# Altium project MiniPC.PrjPcb (part 17 of 17)
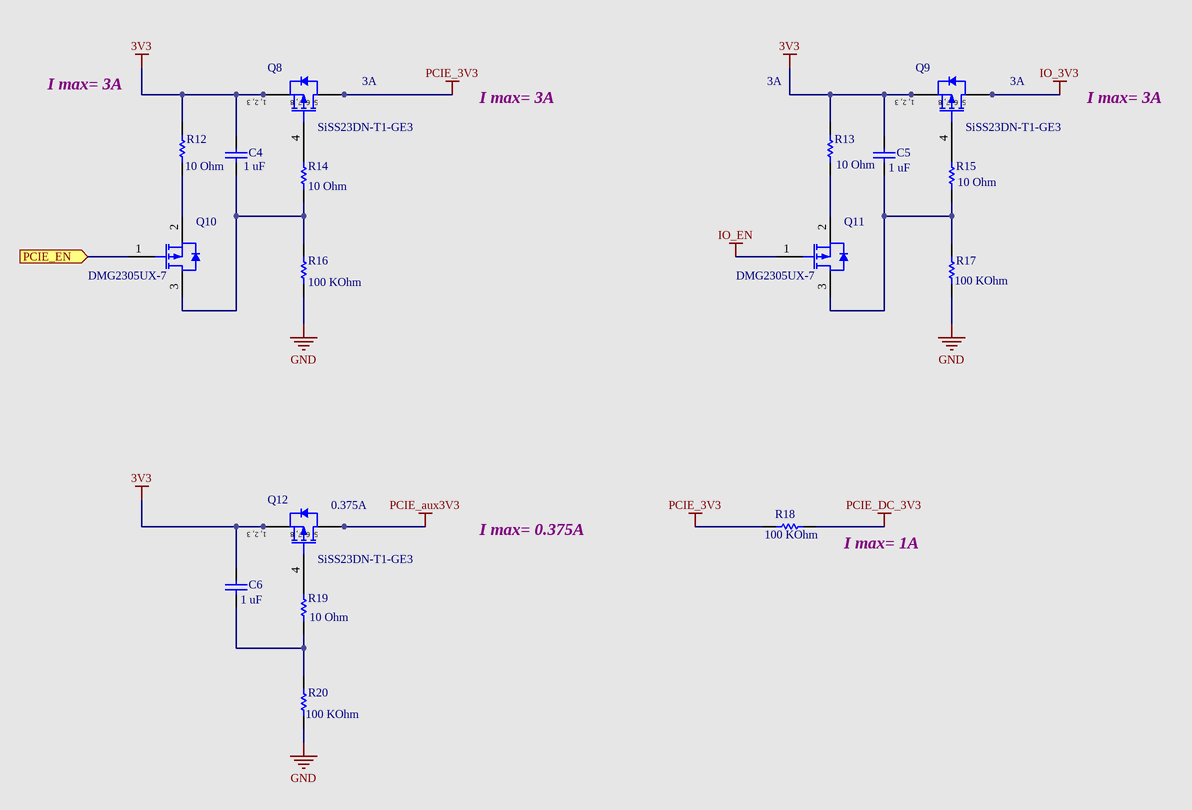
[diagram p51: 3.3V_and_1.8V_Load.SchDoc]

## Nets that join several sheets
0V95: Core_Power_Decoupling (7 pins), Arria10_Power (6 pins), 3V3_to_0V9 (12 pins)
1V8: 12V_3V3_1V8_Swiches (Q17.5 Q17.6 Q17.7 Q17.8), 3V3_to_1V8 (R96.1 R98.2)
2V5: 3V3_to_2V5 (R104.2 R105.2), 2.5V_and_1.8V_Switches (5 pins)
3V3: JTAG_Connector (J12.4 R329.2 R330.1 R331.1), miniPCIE_Connector (C481.2 C482.1 J13.2 J13.52), 12V_3V3_1V8_Swiches (8 pins), 12V_to_3V3 (34 pins), 3V3_to_2V5 (7 pins), 3V3_to_1V8 (19 pins), 3.3V_and_1.8V_Load (14 pins)
A10_0V9: Core_Power_Decoupling (120 pins), Arria10_Power (104 pins), 12V_to_0V9 (36 pins)
A10_0V95_EN: 3.3V_to_0.9V (R31.2), 3V3_to_0V9 (R87.1)
A10_1V0: IO_Power_Decoupling (33 pins), Arria10_Power (32 pins), 3.3V_to_1.0V (R42.1 R44.2)
A10_12V: 12V_3V3_1V8_Swiches (5 pins), 12V_to_0V9 (21 pins)
A10_GNDSENSE: Arria10_Ground (U1.AA18), 12V_to_0V9 (R143.2)
A10_main_1V8: 12V_3V3_1V8_Swiches (5 pins), 2.5V_and_1.8V_Switches (8 pins)
A10_main_3V3: 12V_3V3_1V8_Swiches (Q14.1 Q14.2 Q14.3), 3.3V_to_0.9V (14 pins), 3.3V_to_1.0V (18 pins), 3.3V_to_DDR4_VDD (14 pins), 3.3V_to_VADJ (15 pins), 3V3_to_0V9 (6 pins)
A10_VCCAPLL: IO_Power_Decoupling (C458.2 C459.2 L15.2), Arria10_Power (U1.W18)
A10_VCCLSENSE: Arria10_Power (U1.AA19), 12V_to_0V9 (R142.2)
A10VCCAPLLHPS: IO_Power_Decoupling (C463.2 L16.2), Arria10_Power (U1.N18)
FMCBVADJ: IO_Power_Decoupling (C460.2 C461.2 C462.2), Arria10_Power (16 pins), 3.3V_to_VADJ (R67.2 R69.1)
GND: Core_Power_Decoupling (132 pins), IO_Power_Decoupling (91 pins), DDR4_SODIMM_Arria10 (R237.1), PCIE_Arria10 (8 pins), DP&SDI_Arria10 (12 pins), 2XSFP_Arria10 (U1.AJ28 U1.AJ29), HPS1_Arria10 (7 pins), Arria10_Power (28 pins), Arria10_Ground (401 pins), DDR4 (60 pins), DDR4_SODIMM1 (106 pins), DDR4_SODIMM2 (106 pins), Ethernet-HPS (39 pins), SFP_PortA (31 pins), SFP_PortB (31 pins), JTAG_Connector (J12.10 R328.1), Display_Port (20 pins), Ethernet1 (39 pins), Ethernet2 (39 pins), miniPCIE_Connector (18 pins), USB3.0 (22 pins), PCIE_Connector (50 pins), PLL1 (33 pins), PLL (37 pins), 12V_POWER (13 pins), 12V_3V3_1V8_Swiches (13 pins), 12V_to_0V9 (61 pins), 12V_to_3V3 (59 pins), 12V_to_5V (11 pins), 3.3V_to_0.9V (14 pins), 3.3V_to_1.0V (15 pins), 3.3V_to_DDR4_VDD (14 pins), 3.3V_to_VADJ (14 pins), 3V3_to_0V9 (11 pins), 3V3_to_2V5 (11 pins), 3V3_to_1V8 (15 pins), 2.5V_and_1.8V_Switches (7 pins), 3.3V_and_1.8V_Load (R16.1 R17.1 R20.1)
HPS_0V95: Core_Power_Decoupling (5 pins), Arria10_Power (U1.N17 U1.P16 U1.P18 U1.R18), 3.3V_to_0.9V (R25.2 R27.1)
IO_1V8: IO_Power_Decoupling (14 pins), HPS1_Arria10 (9 pins), Arria10_Power (18 pins), Ethernet-HPS (11 pins), USB3.0 (11 pins), PLL1 (L17.2 L18.2 R333.1 R334.1), PLL (5 pins), 2.5V_and_1.8V_Switches (Q3.1 Q3.2 Q3.3)
IO_2V5: DDR4 (6 pins), DDR4_SODIMM1 (J8.255 J8.257 J8.259 R227.1), DDR4_SODIMM2 (J20.255 J20.257 J20.259 R232.1), Ethernet-HPS (7 pins), Ethernet1 (40 pins), Ethernet2 (40 pins), USB3.0 (X1.4), PLL (9 pins), 2.5V_and_1.8V_Switches (Q1.5 Q1.6 Q1.7 Q1.8)
IO_3V3: Ethernet-HPS (5 pins), SFP_PortA (C551.2 C552.2 L23.1 L24.1), SFP_PortB (C555.2 C557.2 L25.1 L26.1), Display_Port (C297.1 R242.2 U16.5), USB3.0 (6 pins), PLL (C541.2 C542.2 U29.1 U29.10), 3.3V_and_1.8V_Load (Q9.5 Q9.6 Q9.7 Q9.8)
IO_5V: Ethernet-HPS (C384.2 U25.5), Ethernet1 (C327.2 U19.1), Ethernet2 (C353.2 U22.1), 12V_to_5V (11 pins)
IO_EN: 3.3V_to_DDR4_VDD (R59.2), 2.5V_and_1.8V_Switches (Q2.1 R7.2), 3.3V_and_1.8V_Load (Q11.1)
MAIN_12V: 12V_POWER (18 pins), 12V_3V3_1V8_Swiches (8 pins), 12V_to_3V3 (21 pins), 12V_to_5V (F1.2), 2.5V_and_1.8V_Switches (R4.2 R5.2 R8.2 R10.2)
PCIE_12V: PCIE_Connector (11 pins), 12V_POWER (Q21.5 Q21.6 Q21.7 Q21.8)
PCIE_aux3V3: PCIE_Connector (C483.2 J14.B10), 3.3V_and_1.8V_Load (Q12.5 Q12.6 Q12.7 Q12.8)
PCIE_DC_3V3: PCIE_Connector (7 pins), 3.3V_and_1.8V_Load (R18.1)
PCIE_EN: 12V_POWER (R139.1), 3.3V_and_1.8V_Load (Q10.1)
PLL_1V8: IO_Power_Decoupling (25 pins), Arria10_Power (22 pins), 2.5V_and_1.8V_Switches (Q4.1 Q4.2 Q4.3)
PMbus_ALTERTn: 12V_to_0V9 (U10#1.E5), 12V_to_3V3 (R161.1 U23.E5)
PMbus_SCL_3V3: 12V_to_0V9 (U10#1.E6), 12V_to_3V3 (R159.1 U23.E6)
PMbus_SDA_3V3: 12V_to_0V9 (U10#1.D6), 12V_to_3V3 (R160.1 U23.D6)
VCCIO_HPS: IO_Power_Decoupling (C464.2 R326.2), Arria10_Power (U1.M16)
VCCIOREF_HPS: IO_Power_Decoupling (C480.2 R327.2), Arria10_Power (U1.N16)
VDD_DDR: IO_Power_Decoupling (15 pins), Arria10_Power (20 pins), DDR4 (72 pins), DDR4_SODIMM1 (25 pins), DDR4_SODIMM2 (25 pins), 3.3V_to_DDR4_VDD (R53.2 R55.1)
A10_HLVDDI_N: 3.3V_to_1.0V (C23.1 R45.1), 3.3V_to_DDR4_VDD (C26.1 R53.1)
A10_HLVDDI_P: 3.3V_to_1.0V (C23.2 R44.1), 3.3V_to_DDR4_VDD (C26.2 R51.1)
CLK_ENET_FPGA_N: PCIE_Arria10 (U1.AG28), PLL1 (C516.2)
CLK_ENET_FPGA_P: PCIE_Arria10 (U1.AG29), PLL1 (C517.2)
CLOCK_I2C_SCL: PLL1 (U27.12 U28.12), PLL (U30.12)
CLOCK_I2C_SDA: PLL1 (U27.19 U28.19), PLL (U30.19)
DDR4_A0: DDR4_Arria10 (U1.G26), DDR4 (R211.2 U14.P3 U15.P3)
DDR4_A1: DDR4_Arria10 (U1.F23), DDR4 (R212.2 U14.P7 U15.P7)
DDR4_A2: DDR4_Arria10 (U1.D25), DDR4 (R213.2 U14.R3 U15.R3)
DDR4_A3: DDR4_Arria10 (U1.F24), DDR4 (R214.2 U14.N7 U15.N7)
DDR4_A4: DDR4_Arria10 (U1.H24), DDR4 (R215.2 U14.N3 U15.N3)
DDR4_A5: DDR4_Arria10 (U1.B22), DDR4 (R216.2 U14.P8 U15.P8)
DDR4_A6: DDR4_Arria10 (U1.G25), DDR4 (R217.2 U14.P2 U15.P2)
DDR4_A7: DDR4_Arria10 (U1.A20), DDR4 (R218.2 U14.R8 U15.R8)
DDR4_A8: DDR4_Arria10 (U1.E23), DDR4 (R219.2 U14.R2 U15.R2)
DDR4_A9: DDR4_Arria10 (U1.E25), DDR4 (R220.2 U14.R7 U15.R7)
DDR4_A10: DDR4_Arria10 (U1.J24), DDR4 (R222.2 U14.M3 U15.M3)
DDR4_A11: DDR4_Arria10 (U1.C24), DDR4 (R224.2 U14.T2 U15.T2)
DDR4_A12: DDR4_Arria10 (U1.F26), DDR4 (R225.2 U14.M7 U15.M7)
DDR4_A13: DDR4_Arria10 (U1.A19), DDR4 (R226.2 U14.T8 U15.T8)
DDR4_ACT: DDR4_Arria10 (U1.J25), DDR4 (U14.L3 U15.L3)
DDR4_ALERT0: DDR4_Arria10 (U1.L26), DDR4 (U15.P9)
DDR4_ALERT1: DDR4_Arria10 (U1.A22), DDR4 (U14.P9)
DDR4_BA0: DDR4_Arria10 (U1.M24), DDR4 (U14.N2 U15.N2)
DDR4_BA1: DDR4_Arria10 (U1.A23), DDR4 (U14.N8 U15.N8)
DDR4_BG0: DDR4_Arria10 (U1.N24), DDR4 (U15.M2)
DDR4_BG1: DDR4_Arria10 (U1.M25), DDR4 (U14.M2)
DDR4_CAS: DDR4_Arria10 (U1.A24), DDR4 (U14.M8 U15.M8)
DDR4_CKE: DDR4_Arria10 (U1.P25), DDR4 (U14.K2 U15.K2)
DDR4_CLK_N: DDR4_Arria10 (U1.B19), DDR4 (U14.K8 U15.K8)
DDR4_CLK_P: DDR4_Arria10 (U1.B20), DDR4 (U14.K7 U15.K7)
DDR4_CSn: DDR4_Arria10 (U1.A26), DDR4 (U14.L7 U15.L7)
DDR4_DM0: DDR4_Arria10 (U1.AV28), DDR4 (U15.E7)
DDR4_DM1: DDR4_Arria10 (U1.AT23), DDR4 (U15.E2)
DDR4_DM2: DDR4_Arria10 (U1.AK23), DDR4 (U14.E7)
DDR4_DM3: DDR4_Arria10 (U1.AJ26), DDR4 (U14.E2)
DDR4_DQ0: DDR4_Arria10 (U1.AV26), DDR4 (U15.G2)
DDR4_DQ1: DDR4_Arria10 (U1.AW28), DDR4 (U15.F7)
DDR4_DQ2: DDR4_Arria10 (U1.AV24), DDR4 (U15.H3)
DDR4_DQ3: DDR4_Arria10 (U1.AV27), DDR4 (U15.H7)
DDR4_DQ4: DDR4_Arria10 (U1.AW24), DDR4 (U15.H2)
DDR4_DQ5: DDR4_Arria10 (U1.AU28), DDR4 (U15.H8)
DDR4_DQ6: DDR4_Arria10 (U1.AV23), DDR4 (U15.J3)
DDR4_DQ7: DDR4_Arria10 (U1.AU27), DDR4 (U15.J7)
DDR4_DQ8: DDR4_Arria10 (U1.AU26), DDR4 (U15.A3)
DDR4_DQ9: DDR4_Arria10 (U1.AP23), DDR4 (U15.B8)
DDR4_DQ10: DDR4_Arria10 (U1.AT26), DDR4 (U15.C3)
DDR4_DQ11: DDR4_Arria10 (U1.AR26), DDR4 (U15.C7)
DDR4_DQ12: DDR4_Arria10 (U1.AU25), DDR4 (U15.C2)
DDR4_DQ13: DDR4_Arria10 (U1.AP25), DDR4 (U15.C8)
DDR4_DQ14: DDR4_Arria10 (U1.AU24), DDR4 (U15.D3)
DDR4_DQ15: DDR4_Arria10 (U1.AR25), DDR4 (U15.D7)
DDR4_DQ16: DDR4_Arria10 (U1.AN23), DDR4 (U14.G2)
DDR4_DQ17: DDR4_Arria10 (U1.AL23), DDR4 (U14.F7)
DDR4_DQ18: DDR4_Arria10 (U1.AN26), DDR4 (U14.H3)
DDR4_DQ19: DDR4_Arria10 (U1.AM24), DDR4 (U14.H7)
DDR4_DQ20: DDR4_Arria10 (U1.AN24), DDR4 (U14.H2)
DDR4_DQ21: DDR4_Arria10 (U1.AK26), DDR4 (U14.H8)
DDR4_DQ22: DDR4_Arria10 (U1.AP26), DDR4 (U14.J3)
DDR4_DQ23: DDR4_Arria10 (U1.AL26), DDR4 (U14.J7)
DDR4_DQ24: DDR4_Arria10 (U1.AJ24), DDR4 (U14.A3)
DDR4_DQ25: DDR4_Arria10 (U1.AF24), DDR4 (U14.B8)
DDR4_DQ26: DDR4_Arria10 (U1.AH25), DDR4 (U14.C3)
DDR4_DQ27: DDR4_Arria10 (U1.AH23), DDR4 (U14.C7)
DDR4_DQ28: DDR4_Arria10 (U1.AJ23), DDR4 (U14.C2)
DDR4_DQ29: DDR4_Arria10 (U1.AF25), DDR4 (U14.C8)
DDR4_DQ30: DDR4_Arria10 (U1.AH24), DDR4 (U14.D3)
DDR4_DQ31: DDR4_Arria10 (U1.AG25), DDR4 (U14.D7)
DDR4_DQS0_N: DDR4_Arria10 (U1.AW25), DDR4 (U15.F3)
DDR4_DQS0_P: DDR4_Arria10 (U1.AW26), DDR4 (U15.G3)
DDR4_DQS1_N: DDR4_Arria10 (U1.AT24), DDR4 (U15.A7)
DDR4_DQS1_P: DDR4_Arria10 (U1.AT25), DDR4 (U15.B7)
DDR4_DQS2_N: DDR4_Arria10 (U1.AL25), DDR4 (U14.F3)
DDR4_DQS2_P: DDR4_Arria10 (U1.AM25), DDR4 (U14.G3)
DDR4_DQS3_N: DDR4_Arria10 (U1.AJ25), DDR4 (U14.A7)
DDR4_DQS3_P: DDR4_Arria10 (U1.AK25), DDR4 (U14.B7)
DDR4_ODT: DDR4_Arria10 (U1.K26), DDR4 (U14.K3 U15.K3)
DDR4_PAR: DDR4_Arria10 (U1.D24), DDR4 (U14.T3 U15.T3)
DDR4_RAS: DDR4_Arria10 (U1.A25), DDR4 (U14.L8 U15.L8)
DDR4_RESETn: DDR4_Arria10 (U1.L25), DDR4 (R210.1 U14.P1 U15.P1)
DDR4_SODIMM_A0: DDR4_SODIMM_Arria10 (U1.AH2), DDR4_SODIMM1 (J8.144), DDR4_SODIMM2 (J20.144)
DDR4_SODIMM_A1: DDR4_SODIMM_Arria10 (U1.AJ4), DDR4_SODIMM1 (J8.133), DDR4_SODIMM2 (J20.133)
DDR4_SODIMM_A2: DDR4_SODIMM_Arria10 (U1.AM1), DDR4_SODIMM1 (J8.132), DDR4_SODIMM2 (J20.132)
DDR4_SODIMM_A3: DDR4_SODIMM_Arria10 (U1.AJ1), DDR4_SODIMM1 (J8.131), DDR4_SODIMM2 (J20.131)
DDR4_SODIMM_A4: DDR4_SODIMM_Arria10 (U1.AL4), DDR4_SODIMM1 (J8.128), DDR4_SODIMM2 (J20.128)
DDR4_SODIMM_A5: DDR4_SODIMM_Arria10 (U1.AM4), DDR4_SODIMM1 (J8.126), DDR4_SODIMM2 (J20.126)
DDR4_SODIMM_A6: DDR4_SODIMM_Arria10 (U1.AK3), DDR4_SODIMM1 (J8.127), DDR4_SODIMM2 (J20.127)
DDR4_SODIMM_A7: DDR4_SODIMM_Arria10 (U1.AN1), DDR4_SODIMM1 (J8.122), DDR4_SODIMM2 (J20.122)
DDR4_SODIMM_A8: DDR4_SODIMM_Arria10 (U1.AK1), DDR4_SODIMM1 (J8.125), DDR4_SODIMM2 (J20.125)
DDR4_SODIMM_A9: DDR4_SODIMM_Arria10 (U1.AK2), DDR4_SODIMM1 (J8.121), DDR4_SODIMM2 (J20.121)
DDR4_SODIMM_A10: DDR4_SODIMM_Arria10 (U1.AH4), DDR4_SODIMM1 (J8.146), DDR4_SODIMM2 (J20.146)
DDR4_SODIMM_A11: DDR4_SODIMM_Arria10 (U1.AN3), DDR4_SODIMM1 (J8.120), DDR4_SODIMM2 (J20.120)
DDR4_SODIMM_A12: DDR4_SODIMM_Arria10 (U1.AL3), DDR4_SODIMM1 (J8.119), DDR4_SODIMM2 (J20.119)
DDR4_SODIMM_A13: DDR4_SODIMM_Arria10 (U1.AG7), DDR4_SODIMM1 (J8.158), DDR4_SODIMM2 (J20.158)
DDR4_SODIMM_A14: DDR4_SODIMM_Arria10 (U1.AG4), DDR4_SODIMM1 (J8.151), DDR4_SODIMM2 (J20.151)
DDR4_SODIMM_A15: DDR4_SODIMM_Arria10 (U1.AF5), DDR4_SODIMM1 (J8.156), DDR4_SODIMM2 (J20.156)
DDR4_SODIMM_A16: DDR4_SODIMM_Arria10 (U1.AF4), DDR4_SODIMM1 (J8.152), DDR4_SODIMM2 (J20.152)
DDR4_SODIMM_ACT: DDR4_SODIMM1_Arria10 (U1.AV9), DDR4_SODIMM1 (J8.114), DDR4_SODIMM2 (J20.114)
DDR4_SODIMM_ALERT: DDR4_SODIMM1_Arria10 (U1.AU9), DDR4_SODIMM1 (J8.116), DDR4_SODIMM2 (J20.116)
DDR4_SODIMM_BA0: DDR4_SODIMM1_Arria10 (U1.AK11), DDR4_SODIMM1 (J8.150), DDR4_SODIMM2 (J20.150)
DDR4_SODIMM_BA1: DDR4_SODIMM1_Arria10 (U1.AL10), DDR4_SODIMM1 (J8.145), DDR4_SODIMM2 (J20.145)
DDR4_SODIMM_BG0: DDR4_SODIMM1_Arria10 (U1.AN9), DDR4_SODIMM1 (J8.115), DDR4_SODIMM2 (J20.115)
DDR4_SODIMM_BG1: DDR4_SODIMM1_Arria10 (U1.AP8), DDR4_SODIMM1 (J8.113), DDR4_SODIMM2 (J20.113)
DDR4_SODIMM_CK0_N: DDR4_SODIMM_Arria10 (R239.2 U1.AE8), DDR4_SODIMM1 (J8.139)
DDR4_SODIMM_CK0_P: DDR4_SODIMM_Arria10 (R239.1 U1.AF8), DDR4_SODIMM1 (J8.137)
DDR4_SODIMM_CK1_N: DDR4_SODIMM_Arria10 (R238.2 U1.AH3), DDR4_SODIMM1 (J8.140)
DDR4_SODIMM_CK1_P: DDR4_SODIMM_Arria10 (R238.1 U1.AJ3), DDR4_SODIMM1 (J8.138)
DDR4_SODIMM_CK2_N: DDR4_SODIMM_Arria10 (R240.2 U1.AK5), DDR4_SODIMM2 (J20.139)
DDR4_SODIMM_CK2_P: DDR4_SODIMM_Arria10 (R240.1 U1.AL5), DDR4_SODIMM2 (J20.137)
DDR4_SODIMM_CK3_N: DDR4_SODIMM_Arria10 (R241.2 U1.AR2), DDR4_SODIMM2 (J20.140)
DDR4_SODIMM_CK3_P: DDR4_SODIMM_Arria10 (R241.1 U1.AR1), DDR4_SODIMM2 (J20.138)
DDR4_SODIMM_CKE0: DDR4_SODIMM1_Arria10 (U1.AR8), DDR4_SODIMM1 (J8.109 R231.2)
DDR4_SODIMM_CKE1: DDR4_SODIMM1_Arria10 (U1.AW9), DDR4_SODIMM2 (J20.109 R236.2)
DDR4_SODIMM_CS0: DDR4_SODIMM1_Arria10 (U1.AP11), DDR4_SODIMM1 (J8.149)
DDR4_SODIMM_CS1: DDR4_SODIMM1_Arria10 (U1.AM10), DDR4_SODIMM2 (J20.149)
DDR4_SODIMM_DM0: DDR4_SODIMM_Arria10 (U1.AL9), DDR4_SODIMM1 (J8.12), DDR4_SODIMM2 (J20.12)
DDR4_SODIMM_DM1: DDR4_SODIMM_Arria10 (U1.AW4), DDR4_SODIMM1 (J8.33), DDR4_SODIMM2 (J20.33)
DDR4_SODIMM_DM2: DDR4_SODIMM_Arria10 (U1.AN4), DDR4_SODIMM1 (J8.54), DDR4_SODIMM2 (J20.54)
DDR4_SODIMM_DM3: DDR4_SODIMM_Arria10 (U1.AJ9), DDR4_SODIMM1 (J8.75), DDR4_SODIMM2 (J20.75)
DDR4_SODIMM_DM4: DDR4_SODIMM1_Arria10 (U1.AD3), DDR4_SODIMM1 (J8.178), DDR4_SODIMM2 (J20.178)
DDR4_SODIMM_DM5: DDR4_SODIMM1_Arria10 (U1.Y5), DDR4_SODIMM1 (J8.199), DDR4_SODIMM2 (J20.199)
DDR4_SODIMM_DM6: DDR4_SODIMM1_Arria10 (U1.W1), DDR4_SODIMM1 (J8.220), DDR4_SODIMM2 (J20.220)
DDR4_SODIMM_DM7: DDR4_SODIMM1_Arria10 (U1.AA10), DDR4_SODIMM1 (J8.241), DDR4_SODIMM2 (J20.241)
DDR4_SODIMM_DQ0: DDR4_SODIMM_Arria10 (U1.AM9), DDR4_SODIMM1 (J8.8), DDR4_SODIMM2 (J20.8)
DDR4_SODIMM_DQ1: DDR4_SODIMM_Arria10 (U1.AL8), DDR4_SODIMM1 (J8.7), DDR4_SODIMM2 (J20.7)
DDR4_SODIMM_DQ2: DDR4_SODIMM_Arria10 (U1.AM6), DDR4_SODIMM1 (J8.20), DDR4_SODIMM2 (J20.20)
DDR4_SODIMM_DQ3: DDR4_SODIMM_Arria10 (U1.AL7), DDR4_SODIMM1 (J8.21), DDR4_SODIMM2 (J20.21)
DDR4_SODIMM_DQ4: DDR4_SODIMM_Arria10 (U1.AK10), DDR4_SODIMM1 (J8.4), DDR4_SODIMM2 (J20.4)
DDR4_SODIMM_DQ5: DDR4_SODIMM_Arria10 (U1.AK8), DDR4_SODIMM1 (J8.3), DDR4_SODIMM2 (J20.3)
DDR4_SODIMM_DQ6: DDR4_SODIMM_Arria10 (U1.AN6), DDR4_SODIMM1 (J8.16), DDR4_SODIMM2 (J20.16)
DDR4_SODIMM_DQ7: DDR4_SODIMM_Arria10 (U1.AK7), DDR4_SODIMM1 (J8.17), DDR4_SODIMM2 (J20.17)
DDR4_SODIMM_DQ8: DDR4_SODIMM_Arria10 (U1.AU6), DDR4_SODIMM1 (J8.28), DDR4_SODIMM2 (J20.28)
DDR4_SODIMM_DQ9: DDR4_SODIMM_Arria10 (U1.AW5), DDR4_SODIMM1 (J8.29), DDR4_SODIMM2 (J20.29)
DDR4_SODIMM_DQ10: DDR4_SODIMM_Arria10 (U1.AU4), DDR4_SODIMM1 (J8.41), DDR4_SODIMM2 (J20.41)
DDR4_SODIMM_DQ11: DDR4_SODIMM_Arria10 (U1.AT5), DDR4_SODIMM1 (J8.42), DDR4_SODIMM2 (J20.42)
DDR4_SODIMM_DQ12: DDR4_SODIMM_Arria10 (U1.AR6), DDR4_SODIMM1 (J8.24), DDR4_SODIMM2 (J20.24)
DDR4_SODIMM_DQ13: DDR4_SODIMM_Arria10 (U1.AU5), DDR4_SODIMM1 (J8.25), DDR4_SODIMM2 (J20.25)
DDR4_SODIMM_DQ14: DDR4_SODIMM_Arria10 (U1.AT4), DDR4_SODIMM1 (J8.38), DDR4_SODIMM2 (J20.38)
DDR4_SODIMM_DQ15: DDR4_SODIMM_Arria10 (U1.AV4), DDR4_SODIMM1 (J8.37), DDR4_SODIMM2 (J20.37)
DDR4_SODIMM_DQ16: DDR4_SODIMM_Arria10 (U1.AU1), DDR4_SODIMM1 (J8.50), DDR4_SODIMM2 (J20.50)
DDR4_SODIMM_DQ17: DDR4_SODIMM_Arria10 (U1.AR3), DDR4_SODIMM1 (J8.49), DDR4_SODIMM2 (J20.49)
DDR4_SODIMM_DQ18: DDR4_SODIMM_Arria10 (U1.AM5), DDR4_SODIMM1 (J8.62), DDR4_SODIMM2 (J20.62)
DDR4_SODIMM_DQ19: DDR4_SODIMM_Arria10 (U1.AP4), DDR4_SODIMM1 (J8.63), DDR4_SODIMM2 (J20.63)
DDR4_SODIMM_DQ20: DDR4_SODIMM_Arria10 (U1.AU2), DDR4_SODIMM1 (J8.46), DDR4_SODIMM2 (J20.46)
DDR4_SODIMM_DQ21: DDR4_SODIMM_Arria10 (U1.AT3), DDR4_SODIMM1 (J8.45), DDR4_SODIMM2 (J20.45)
DDR4_SODIMM_DQ22: DDR4_SODIMM_Arria10 (U1.AP5), DDR4_SODIMM1 (J8.58), DDR4_SODIMM2 (J20.58)
DDR4_SODIMM_DQ23: DDR4_SODIMM_Arria10 (U1.AP3), DDR4_SODIMM1 (J8.59), DDR4_SODIMM2 (J20.59)
DDR4_SODIMM_DQ24: DDR4_SODIMM_Arria10 (U1.AH11), DDR4_SODIMM1 (J8.70), DDR4_SODIMM2 (J20.70)
DDR4_SODIMM_DQ25: DDR4_SODIMM_Arria10 (U1.AH9), DDR4_SODIMM1 (J8.71), DDR4_SODIMM2 (J20.71)
DDR4_SODIMM_DQ26: DDR4_SODIMM_Arria10 (U1.AH8), DDR4_SODIMM1 (J8.83), DDR4_SODIMM2 (J20.83)
DDR4_SODIMM_DQ27: DDR4_SODIMM_Arria10 (U1.AF12), DDR4_SODIMM1 (J8.84), DDR4_SODIMM2 (J20.84)
DDR4_SODIMM_DQ28: DDR4_SODIMM_Arria10 (U1.AG12), DDR4_SODIMM1 (J8.66), DDR4_SODIMM2 (J20.66)
DDR4_SODIMM_DQ29: DDR4_SODIMM_Arria10 (U1.AJ10), DDR4_SODIMM1 (J8.67), DDR4_SODIMM2 (J20.67)
DDR4_SODIMM_DQ30: DDR4_SODIMM_Arria10 (U1.AJ8), DDR4_SODIMM1 (J8.79), DDR4_SODIMM2 (J20.79)
DDR4_SODIMM_DQ31: DDR4_SODIMM_Arria10 (U1.AG11), DDR4_SODIMM1 (J8.80), DDR4_SODIMM2 (J20.80)
DDR4_SODIMM_DQ32: DDR4_SODIMM1_Arria10 (U1.AE3), DDR4_SODIMM1 (J8.174), DDR4_SODIMM2 (J20.174)
DDR4_SODIMM_DQ33: DDR4_SODIMM1_Arria10 (U1.AF2), DDR4_SODIMM1 (J8.173), DDR4_SODIMM2 (J20.173)
DDR4_SODIMM_DQ34: DDR4_SODIMM1_Arria10 (U1.AE1), DDR4_SODIMM1 (J8.187), DDR4_SODIMM2 (J20.187)
DDR4_SODIMM_DQ35: DDR4_SODIMM1_Arria10 (U1.AC1), DDR4_SODIMM1 (J8.186), DDR4_SODIMM2 (J20.186)
DDR4_SODIMM_DQ36: DDR4_SODIMM1_Arria10 (U1.AF3), DDR4_SODIMM1 (J8.170), DDR4_SODIMM2 (J20.170)
DDR4_SODIMM_DQ37: DDR4_SODIMM1_Arria10 (U1.AG2), DDR4_SODIMM1 (J8.169), DDR4_SODIMM2 (J20.169)
DDR4_SODIMM_DQ38: DDR4_SODIMM1_Arria10 (U1.AE2), DDR4_SODIMM1 (J8.183), DDR4_SODIMM2 (J20.183)
DDR4_SODIMM_DQ39: DDR4_SODIMM1_Arria10 (U1.AD1), DDR4_SODIMM1 (J8.182), DDR4_SODIMM2 (J20.182)
DDR4_SODIMM_DQ40: DDR4_SODIMM1_Arria10 (U1.AC6), DDR4_SODIMM1 (J8.195), DDR4_SODIMM2 (J20.195)
DDR4_SODIMM_DQ41: DDR4_SODIMM1_Arria10 (U1.AD4), DDR4_SODIMM1 (J8.194), DDR4_SODIMM2 (J20.194)
DDR4_SODIMM_DQ42: DDR4_SODIMM1_Arria10 (U1.Y6), DDR4_SODIMM1 (J8.207), DDR4_SODIMM2 (J20.207)
DDR4_SODIMM_DQ43: DDR4_SODIMM1_Arria10 (U1.AB5), DDR4_SODIMM1 (J8.208), DDR4_SODIMM2 (J20.208)
DDR4_SODIMM_DQ44: DDR4_SODIMM1_Arria10 (U1.AA5), DDR4_SODIMM1 (J8.191), DDR4_SODIMM2 (J20.191)
DDR4_SODIMM_DQ45: DDR4_SODIMM1_Arria10 (U1.AD5), DDR4_SODIMM1 (J8.190), DDR4_SODIMM2 (J20.190)
DDR4_SODIMM_DQ46: DDR4_SODIMM1_Arria10 (U1.AB6), DDR4_SODIMM1 (J8.203), DDR4_SODIMM2 (J20.203)
DDR4_SODIMM_DQ47: DDR4_SODIMM1_Arria10 (U1.AD6), DDR4_SODIMM1 (J8.204), DDR4_SODIMM2 (J20.204)
DDR4_SODIMM_DQ48: DDR4_SODIMM1_Arria10 (U1.AB1), DDR4_SODIMM1 (J8.216), DDR4_SODIMM2 (J20.216)
DDR4_SODIMM_DQ49: DDR4_SODIMM1_Arria10 (U1.AB4), DDR4_SODIMM1 (J8.215), DDR4_SODIMM2 (J20.215)
DDR4_SODIMM_DQ50: DDR4_SODIMM1_Arria10 (U1.Y3), DDR4_SODIMM1 (J8.228), DDR4_SODIMM2 (J20.228)
DDR4_SODIMM_DQ51: DDR4_SODIMM1_Arria10 (U1.Y1), DDR4_SODIMM1 (J8.229), DDR4_SODIMM2 (J20.229)
DDR4_SODIMM_DQ52: DDR4_SODIMM1_Arria10 (U1.AC4), DDR4_SODIMM1 (J8.211), DDR4_SODIMM2 (J20.211)
DDR4_SODIMM_DQ53: DDR4_SODIMM1_Arria10 (U1.AB2), DDR4_SODIMM1 (J8.212), DDR4_SODIMM2 (J20.212)
DDR4_SODIMM_DQ54: DDR4_SODIMM1_Arria10 (U1.Y2), DDR4_SODIMM1 (J8.224), DDR4_SODIMM2 (J20.224)
DDR4_SODIMM_DQ55: DDR4_SODIMM1_Arria10 (U1.AA4), DDR4_SODIMM1 (J8.225), DDR4_SODIMM2 (J20.225)
DDR4_SODIMM_DQ56: DDR4_SODIMM1_Arria10 (U1.Y10), DDR4_SODIMM1 (J8.237), DDR4_SODIMM2 (J20.237)
DDR4_SODIMM_DQ57: DDR4_SODIMM1_Arria10 (U1.AB9), DDR4_SODIMM1 (J8.236), DDR4_SODIMM2 (J20.236)
DDR4_SODIMM_DQ58: DDR4_SODIMM1_Arria10 (U1.AB11), DDR4_SODIMM1 (J8.249), DDR4_SODIMM2 (J20.249)
DDR4_SODIMM_DQ59: DDR4_SODIMM1_Arria10 (U1.W8), DDR4_SODIMM1 (J8.250), DDR4_SODIMM2 (J20.250)
DDR4_SODIMM_DQ60: DDR4_SODIMM1_Arria10 (U1.AB7), DDR4_SODIMM1 (J8.232), DDR4_SODIMM2 (J20.232)
DDR4_SODIMM_DQ61: DDR4_SODIMM1_Arria10 (U1.AA9), DDR4_SODIMM1 (J8.233), DDR4_SODIMM2 (J20.233)
DDR4_SODIMM_DQ62: DDR4_SODIMM1_Arria10 (U1.AB10), DDR4_SODIMM1 (J8.245), DDR4_SODIMM2 (J20.245)
DDR4_SODIMM_DQ63: DDR4_SODIMM1_Arria10 (U1.Y8), DDR4_SODIMM1 (J8.246), DDR4_SODIMM2 (J20.246)
DDR4_SODIMM_DQS0_N: DDR4_SODIMM_Arria10 (U1.AM7), DDR4_SODIMM1 (J8.11), DDR4_SODIMM2 (J20.11)
DDR4_SODIMM_DQS0_P: DDR4_SODIMM_Arria10 (U1.AN7), DDR4_SODIMM1 (J8.13), DDR4_SODIMM2 (J20.13)
DDR4_SODIMM_DQS1_N: DDR4_SODIMM_Arria10 (U1.AV6), DDR4_SODIMM1 (J8.32), DDR4_SODIMM2 (J20.32)
DDR4_SODIMM_DQS1_P: DDR4_SODIMM_Arria10 (U1.AW6), DDR4_SODIMM1 (J8.34), DDR4_SODIMM2 (J20.34)
DDR4_SODIMM_DQS2_N: DDR4_SODIMM_Arria10 (U1.AP6), DDR4_SODIMM1 (J8.53), DDR4_SODIMM2 (J20.53)
DDR4_SODIMM_DQS2_P: DDR4_SODIMM_Arria10 (U1.AR5), DDR4_SODIMM1 (J8.55), DDR4_SODIMM2 (J20.55)
DDR4_SODIMM_DQS3_N: DDR4_SODIMM_Arria10 (U1.AG10), DDR4_SODIMM1 (J8.74), DDR4_SODIMM2 (J20.74)
DDR4_SODIMM_DQS3_P: DDR4_SODIMM_Arria10 (U1.AG9), DDR4_SODIMM1 (J8.76), DDR4_SODIMM2 (J20.76)
DDR4_SODIMM_DQS4_N: DDR4_SODIMM1_Arria10 (U1.AG1), DDR4_SODIMM1 (J8.177), DDR4_SODIMM2 (J20.177)
DDR4_SODIMM_DQS4_P: DDR4_SODIMM1_Arria10 (U1.AH1), DDR4_SODIMM1 (J8.179), DDR4_SODIMM2 (J20.179)
DDR4_SODIMM_DQS5_N: DDR4_SODIMM1_Arria10 (U1.AE6), DDR4_SODIMM1 (J8.198), DDR4_SODIMM2 (J20.198)
DDR4_SODIMM_DQS5_P: DDR4_SODIMM1_Arria10 (U1.AE5), DDR4_SODIMM1 (J8.200), DDR4_SODIMM2 (J20.200)
DDR4_SODIMM_DQS6_N: DDR4_SODIMM1_Arria10 (U1.AA3), DDR4_SODIMM1 (J8.219), DDR4_SODIMM2 (J20.219)
DDR4_SODIMM_DQS6_P: DDR4_SODIMM1_Arria10 (U1.AA2), DDR4_SODIMM1 (J8.221), DDR4_SODIMM2 (J20.221)
DDR4_SODIMM_DQS7_N: DDR4_SODIMM1_Arria10 (U1.AA8), DDR4_SODIMM1 (J8.240), DDR4_SODIMM2 (J20.240)
DDR4_SODIMM_DQS7_P: DDR4_SODIMM1_Arria10 (U1.AA7), DDR4_SODIMM1 (J8.242), DDR4_SODIMM2 (J20.242)
DDR4_SODIMM_ODT0: DDR4_SODIMM1_Arria10 (U1.AK12), DDR4_SODIMM1 (J8.155)
DDR4_SODIMM_ODT1: DDR4_SODIMM1_Arria10 (U1.AR12), DDR4_SODIMM2 (J20.155)
DDR4_SODIMM_PARITY: DDR4_SODIMM1_Arria10 (U1.AP9), DDR4_SODIMM1 (J8.143), DDR4_SODIMM2 (J20.143)
DDR4_SODIMM_RESET_CONN: DDR4_SODIMM1_Arria10 (U1.AW10), DDR4_SODIMM1 (J8.108), DDR4_SODIMM2 (J20.108)
DDR4_SODIMM_SA0: DDR4_SODIMM1_Arria10 (U1.AN12), DDR4_SODIMM1 (J8.256), DDR4_SODIMM2 (J20.256)
DDR4_SODIMM_SA1: DDR4_SODIMM1_Arria10 (U1.AL13), DDR4_SODIMM1 (J8.260), DDR4_SODIMM2 (J20.260)
DDR4_SODIMM_SA2: DDR4_SODIMM1_Arria10 (U1.AM12), DDR4_SODIMM1 (J8.166), DDR4_SODIMM2 (J20.166)
DDR4_SODIMM_SCL: DDR4_SODIMM1_Arria10 (U1.AN13), DDR4_SODIMM1 (J8.253), DDR4_SODIMM2 (J20.253)
DDR4_SODIMM_SDA: DDR4_SODIMM1_Arria10 (U1.AL12), DDR4_SODIMM1 (J8.254), DDR4_SODIMM2 (J20.254)
DDR4_WEn: DDR4_Arria10 (U1.N25), DDR4 (U14.L2 U15.L2)
DP_ML_LANE0_N: DP&SDI_Arria10 (U1.B34), Display_Port (C307.1)
DP_ML_LANE0_P: DP&SDI_Arria10 (U1.B35), Display_Port (C309.1)
DP_ML_LANE1_N: DP&SDI_Arria10 (U1.A36), Display_Port (C305.1)
DP_ML_LANE1_P: DP&SDI_Arria10 (U1.A37), Display_Port (C306.1)
DP_ML_LANE2_N: DP&SDI_Arria10 (U1.B38), Display_Port (C303.1)
DP_ML_LANE2_P: DP&SDI_Arria10 (U1.B39), Display_Port (C304.1)
DP_ML_LANE3_N: DP&SDI_Arria10 (U1.C36), Display_Port (C301.1)
DP_ML_LANE3_P: DP&SDI_Arria10 (U1.C37), Display_Port (C302.1)
ENET_HPS_GTX_CLK: HPS_Arria10 (U1.H18), Ethernet-HPS (U11.24)
ENET_HPS_MDC: HPS_Arria10 (U1.G19), Ethernet-HPS (R302.1 U11.36)
ENET_HPS_MDIO: HPS_Arria10 (U1.F18), Ethernet-HPS (R300.1 U11.37)
ENET_HPS_RX_CLK: HPS_Arria10 (U1.G17), Ethernet-HPS (R312.2 U11.35)
ENET_HPS_RX_DV: HPS_Arria10 (U1.H19), Ethernet-HPS (R309.1 U11.33)
ENET_HPS_RXD0: HPS_Arria10 (U1.E20), Ethernet-HPS (R310.2 U11.32)
ENET_HPS_RXD1: HPS_Arria10 (U1.F20), Ethernet-HPS (R308.2 U11.31)
ENET_HPS_RXD2: HPS_Arria10 (U1.F19), Ethernet-HPS (R306.2 U11.28)
ENET_HPS_RXD3: HPS_Arria10 (U1.F22), Ethernet-HPS (R303.2 U11.27)
ENET_HPS_TX_EN: HPS_Arria10 (U1.G20), Ethernet-HPS (U11.25)
ENET_HPS_TXD0: HPS_Arria10 (U1.K20), Ethernet-HPS (U11.19)
ENET_HPS_TXD1: HPS_Arria10 (U1.K21), Ethernet-HPS (U11.20)
ENET_HPS_TXD2: HPS_Arria10 (U1.G21), Ethernet-HPS (U11.21)
ENET_HPS_TXD3: HPS_Arria10 (U1.G22), Ethernet-HPS (U11.22)
ENETA_INTn: Ethernet1 (R261.1 U17.A12), Ethernet2 (R285.1 U20.A12)
ENETA_MDC: Ethernet1 (R259.1 U17.A14), Ethernet2 (R283.1 U20.A14)
ENETA_MDIO: Ethernet1 (R260.1 U17.A13), Ethernet2 (R284.1 U20.A13)
ENETA_RESETn: Ethernet1 (R263.1 U17.B13), Ethernet2 (R287.1 U20.B13)
ENETA_RX_N: PCIE_Arria10 (U1.AG32), Ethernet1 (C317.1)
ENETA_RX_P: PCIE_Arria10 (U1.AG33), Ethernet1 (C316.1)
ENETA_TX_N: PCIE_Arria10 (U1.AK38), Ethernet1 (C315.1)
ENETA_TX_P: PCIE_Arria10 (U1.AK39), Ethernet1 (C313.1)
ENETB_RX_N: PCIE_Arria10 (U1.AH34), Ethernet2 (C343.1)
ENETB_RX_P: PCIE_Arria10 (U1.AH35), Ethernet2 (C342.1)
ENETB_TX_N: PCIE_Arria10 (U1.AL36), Ethernet2 (C341.1)
ENETB_TX_P: PCIE_Arria10 (U1.AL37), Ethernet2 (C339.1)
EXTA_SDA: SFP_PortA (J7.4), PCIE_Connector (J14.B6)
HPS_CLK1: HPS_Arria10 (U1.G15), PLL (U31.1)
JTAG_TCK: HPS1_Arria10 (U1.AW15), JTAG_Connector (J12.1 R328.2)
JTAG_TDI: HPS1_Arria10 (U1.AL15), JTAG_Connector (J12.9 R330.2)
JTAG_TDO: HPS1_Arria10 (U1.AW14), JTAG_Connector (J12.3)
JTAG_TMS: HPS1_Arria10 (U1.AV13), JTAG_Connector (J12.5 R331.2)
JTAG_TRST: HPS1_Arria10 (U1.AR13), JTAG_Connector (J12.7)
mini_PCIE_PER_N: miniPCIE_Arria10 (U1.D9), miniPCIE_Connector (J13.23)
mini_PCIE_PER_P: miniPCIE_Arria10 (U1.C9), miniPCIE_Connector (J13.25)
mini_PCIE_SMB_CLK: miniPCIE_Arria10 (U1.C14), miniPCIE_Connector (J13.30)
mini_PCIE_SMB_DATA: miniPCIE_Arria10 (U1.D14), miniPCIE_Connector (J13.32)
mini_PCIE_USB_D_N: miniPCIE_Arria10 (U1.D13), miniPCIE_Connector (J13.36)
mini_PCIE_USB_D_P: miniPCIE_Arria10 (U1.C13), miniPCIE_Connector (J13.38)
miniPCIE_CLKREQ_L: miniPCIE_Arria10 (U1.B11), miniPCIE_Connector (J13.7)
miniPCIE_LED_WLAN_L: miniPCIE_Arria10 (U1.B10), miniPCIE_Connector (J13.44)
miniPCIE_PERST_L: miniPCIE_Arria10 (U1.A9), miniPCIE_Connector (J13.22)
miniPCIE_PET_N: miniPCIE_Arria10 (U1.A13), miniPCIE_Connector (J13.31)
miniPCIE_PET_P: miniPCIE_Arria10 (U1.A12), miniPCIE_Connector (J13.33)
miniPCIE_REFCLK_N: miniPCIE_Arria10 (U1.A8), miniPCIE_Connector (J13.11)
miniPCIE_REFCLK_P: miniPCIE_Arria10 (U1.A7), miniPCIE_Connector (J13.13)
miniPCIE_W_DISABLE_L: miniPCIE_Arria10 (U1.B9), miniPCIE_Connector (J13.20)
miniPCIE_WAKE_L: miniPCIE_Arria10 (U1.B12), miniPCIE_Connector (J13.1)
PCIE_PERSTn: PCIE_Arria10 (U1.AH38), PCIE_Connector (J14.A11 R332.1)
PCIE_REFCLK_QR0_N: PCIE_Arria10 (U1.AE28), PLL (R336.2)
PCIE_REFCLK_QR0_P: PCIE_Arria10 (U1.AE29), PLL (R335.2)
PCIE_REFCLK_SYN_N: PCIE_Connector (J14.A14), PLL (R338.2)
PCIE_REFCLK_SYN_P: PCIE_Connector (J14.A13), PLL (R337.2)
PCIE_RX0_N: PCIE_Arria10 (U1.AE32), PCIE_Connector (J14.A17)
PCIE_RX0_P: PCIE_Arria10 (U1.AE33), PCIE_Connector (J14.A16)
PCIE_RX1_N: PCIE_Arria10 (U1.AD30), PCIE_Connector (J14.A22)
PCIE_RX1_P: PCIE_Arria10 (U1.AD31), PCIE_Connector (J14.A21)
PCIE_RX2_N: PCIE_Arria10 (U1.AD34), PCIE_Connector (J14.A26)
PCIE_RX2_P: PCIE_Arria10 (U1.AD35), PCIE_Connector (J14.A25)
PCIE_RX3_N: PCIE_Arria10 (U1.AC32), PCIE_Connector (J14.A30)
PCIE_RX3_P: PCIE_Arria10 (U1.AC33), PCIE_Connector (J14.A29)
PCIE_RX4_N: PCIE_Arria10 (U1.AB30), PCIE_Connector (J14.A36)
PCIE_RX4_P: PCIE_Arria10 (U1.AB31), PCIE_Connector (J14.A35)
PCIE_RX5_N: PCIE_Arria10 (U1.AB34), PCIE_Connector (J14.A40)
PCIE_RX5_P: PCIE_Arria10 (U1.AB35), PCIE_Connector (J14.A39)
PCIE_RX6_N: PCIE_Arria10 (U1.AA32), PCIE_Connector (J14.A44)
PCIE_RX6_P: PCIE_Arria10 (U1.AA33), PCIE_Connector (J14.A43)
PCIE_RX7_N: PCIE_Arria10 (U1.Y34), PCIE_Connector (J14.A48)
PCIE_RX7_P: PCIE_Arria10 (U1.Y35), PCIE_Connector (J14.A47)
PCIE_TX0_N: PCIE_Arria10 (U1.AG36), PCIE_Connector (C485.1)
PCIE_TX0_P: PCIE_Arria10 (U1.AG37), PCIE_Connector (C484.1)
PCIE_TX1_N: PCIE_Arria10 (U1.AF38), PCIE_Connector (C487.1)
PCIE_TX1_P: PCIE_Arria10 (U1.AF39), PCIE_Connector (C486.1)
PCIE_TX2_N: PCIE_Arria10 (U1.AE36), PCIE_Connector (C489.1)
PCIE_TX2_P: PCIE_Arria10 (U1.AE37), PCIE_Connector (C488.1)
PCIE_TX3_N: PCIE_Arria10 (U1.AD38), PCIE_Connector (C491.1)
PCIE_TX3_P: PCIE_Arria10 (U1.AD39), PCIE_Connector (C490.1)
PCIE_TX4_N: PCIE_Arria10 (U1.AC36), PCIE_Connector (C493.1)
PCIE_TX4_P: PCIE_Arria10 (U1.AC37), PCIE_Connector (C492.1)
PCIE_TX5_N: PCIE_Arria10 (U1.AB38), PCIE_Connector (C495.1)
PCIE_TX5_P: PCIE_Arria10 (U1.AB39), PCIE_Connector (C494.1)
PCIE_TX6_N: PCIE_Arria10 (U1.AA36), PCIE_Connector (C497.1)
PCIE_TX6_P: PCIE_Arria10 (U1.AA37), PCIE_Connector (C496.1)
PCIE_TX7_N: PCIE_Arria10 (U1.Y38), PCIE_Connector (C499.1)
PCIE_TX7_P: PCIE_Arria10 (U1.Y39), PCIE_Connector (C498.1)
REFCLK0_FMCB_N: 2XSFP_Arria10 (U1.AL28), PLL1 (C520.2)
REFCLK0_FMCB_P: 2XSFP_Arria10 (U1.AL29), PLL1 (C521.2)
REFCLK1_FMCB_N: PCIE_Arria10 (U1.U28), PLL1 (C522.2)
REFCLK1_FMCB_P: PCIE_Arria10 (U1.U29), PLL1 (C523.2)
REFCLK_DP_N: DP&SDI_Arria10 (U1.G28), PLL1 (C518.2)
REFCLK_DP_P: DP&SDI_Arria10 (U1.G29), PLL1 (C519.2)
REFCLK_SDI_N: DP&SDI_Arria10 (U1.E28), PLL (C545.1)
REFCLK_SDI_P: DP&SDI_Arria10 (U1.E29), PLL (C544.1)
REFCLK_SMA_N: DP&SDI_Arria10 (U1.J28), PLL1 (C524.1 U28.10)
REFCLK_SMA_P: DP&SDI_Arria10 (U1.J29), PLL1 (C531.1 U28.9)
SFPA_RX_N: 2XSFP_Arria10 (U1.AU32), SFP_PortA (J7.12)
SFPA_RX_P: 2XSFP_Arria10 (U1.AU33), SFP_PortA (J7.13)
SFPA_TX_N: 2XSFP_Arria10 (U1.AW32), SFP_PortA (J7.19)
SFPA_TX_P: 2XSFP_Arria10 (U1.AW33), SFP_PortA (J7.18)
SFPB_RX_N: 2XSFP_Arria10 (U1.AT30), SFP_PortB (J21.12)
SFPB_RX_P: 2XSFP_Arria10 (U1.AT31), SFP_PortB (J21.13)
SFPB_TX_N: 2XSFP_Arria10 (U1.AW36), SFP_PortB (J21.19)
SFPB_TX_P: 2XSFP_Arria10 (U1.AW37), SFP_PortB (J21.18)
USB3_BE0: USB3.0_Arria10 (U1.AU17), USB3.0 (U33.4)
USB3_BE1: USB3.0_Arria10 (U1.AV17), USB3.0 (U33.5)
USB3_BE2: USB3.0_Arria10 (U1.AU16), USB3.0 (U33.6)
USB3_BE3: USB3.0_Arria10 (U1.AW16), USB3.0 (U33.7)
USB3_CLK: USB3.0_Arria10 (U1.AL17), USB3.0 (U33.58)
USB3_D0: USB3.0_Arria10 (U1.AH19), USB3.0 (U33.40)
USB3_D1: USB3.0_Arria10 (U1.AJ19), USB3.0 (U33.41)
USB3_D2: USB3.0_Arria10 (U1.AH18), USB3.0 (U33.42)
USB3_D3: USB3.0_Arria10 (U1.AJ18), USB3.0 (U33.43)
USB3_D4: USB3.0_Arria10 (U1.AK18), USB3.0 (U33.44)
USB3_D5: USB3.0_Arria10 (U1.AL18), USB3.0 (U33.45)
USB3_D6: USB3.0_Arria10 (U1.AH17), USB3.0 (U33.46)
USB3_D7: USB3.0_Arria10 (U1.AK17), USB3.0 (U33.47)
USB3_D8: USB3.0_Arria10 (U1.AJ16), USB3.0 (U33.50)
USB3_D9: USB3.0_Arria10 (U1.AK16), USB3.0 (U33.51)
USB3_D10: USB3.0_Arria10 (U1.AP20), USB3.0 (U33.52)
USB3_D11: USB3.0_Arria10 (U1.AM20), USB3.0 (U33.53)
USB3_D12: USB3.0_Arria10 (U1.AM19), USB3.0 (U33.54)
USB3_D13: USB3.0_Arria10 (U1.AL19), USB3.0 (U33.55)
USB3_D14: USB3.0_Arria10 (U1.AN18), USB3.0 (U33.56)
USB3_D15: USB3.0_Arria10 (U1.AP18), USB3.0 (U33.57)
USB3_D16: USB3.0_Arria10 (U1.AM17), USB3.0 (U33.60)
USB3_D17: USB3.0_Arria10 (U1.AM16), USB3.0 (U33.61)
USB3_D18: USB3.0_Arria10 (U1.AN16), USB3.0 (U33.62)
USB3_D19: USB3.0_Arria10 (U1.AT20), USB3.0 (U33.63)
USB3_D20: USB3.0_Arria10 (U1.AR20), USB3.0 (U33.64)
USB3_D21: USB3.0_Arria10 (U1.AT19), USB3.0 (U33.65)
USB3_D22: USB3.0_Arria10 (U1.AP19), USB3.0 (U33.66)
USB3_D23: USB3.0_Arria10 (U1.AN19), USB3.0 (U33.67)
USB3_D24: USB3.0_Arria10 (U1.AV22), USB3.0 (U33.69)
USB3_D25: USB3.0_Arria10 (U1.AW21), USB3.0 (U33.70)
USB3_D26: USB3.0_Arria10 (U1.AU20), USB3.0 (U33.71)
USB3_D27: USB3.0_Arria10 (U1.AU19), USB3.0 (U33.72)
USB3_D28: USB3.0_Arria10 (U1.AV19), USB3.0 (U33.73)
USB3_D29: USB3.0_Arria10 (U1.AW19), USB3.0 (U33.74)
USB3_D30: USB3.0_Arria10 (U1.AV18), USB3.0 (U33.75)
USB3_D31: USB3.0_Arria10 (U1.AW18), USB3.0 (U33.76)
USB3_OE: USB3.0_Arria10 (U1.AP16), USB3.0 (U33.13)
USB3_RD: USB3.0_Arria10 (U1.AT17), USB3.0 (U33.12)
USB3_RESERVED: USB3.0_Arria10 (U1.AR16), USB3.0 (U33.19)
USB3_RXF: USB3.0_Arria10 (U1.AT18), USB3.0 (U33.9)
USB3_SIWU: USB3.0_Arria10 (U1.AN17), USB3.0 (U33.10)
USB3_TXE: USB3.0_Arria10 (U1.AR18), USB3.0 (U33.8)
USB3_WAKEUP: USB3.0_Arria10 (U1.AV16), USB3.0 (U33.16)
USB3_WR: USB3.0_Arria10 (U1.AR17), USB3.0 (U33.11)